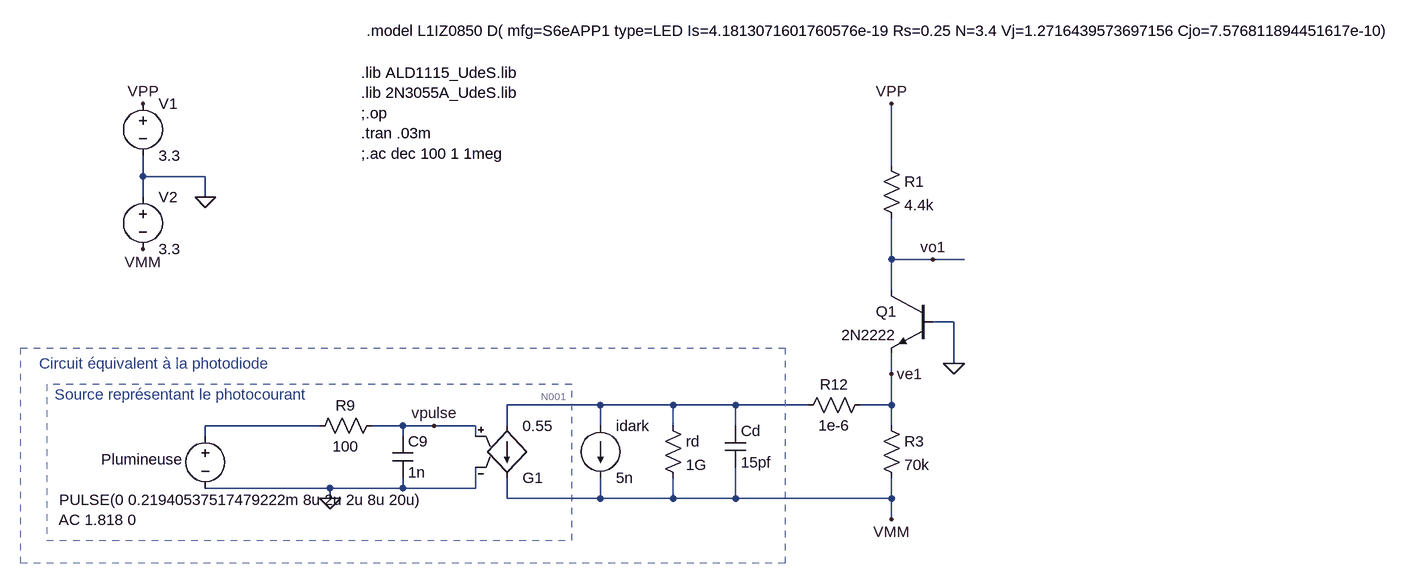
[diagram p0: schematic S6eAPP1_probl_initiale.asc]
S6eAPP1_probl_initiale.asc, the LTspice schematic file:
Version 4
SHEET 1 2260 1556
WIRE 176 48 176 -48
WIRE -976 64 -976 32
WIRE -880 64 -976 64
WIRE -976 96 -976 64
WIRE -880 96 -880 64
WIRE 176 192 176 128
WIRE 240 192 176 192
WIRE 288 192 240 192
WIRE 176 240 176 192
WIRE 272 288 240 288
WIRE 272 352 272 288
WIRE 176 368 176 336
WIRE -272 416 -416 416
WIRE -160 416 -272 416
WIRE -64 416 -160 416
WIRE 48 416 -64 416
WIRE 176 416 176 368
WIRE 176 416 128 416
WIRE -704 448 -880 448
WIRE -576 448 -624 448
WIRE -528 448 -576 448
WIRE -464 448 -528 448
WIRE -416 448 -416 416
WIRE -272 448 -272 416
WIRE -160 448 -160 416
WIRE -64 448 -64 416
WIRE 176 448 176 416
WIRE -880 464 -880 448
WIRE -576 464 -576 448
WIRE -464 464 -464 448
WIRE -688 544 -880 544
WIRE -576 544 -576 528
WIRE -576 544 -688 544
WIRE -464 544 -464 512
WIRE -464 544 -576 544
WIRE -688 560 -688 544
WIRE -416 560 -416 528
WIRE -272 560 -272 528
WIRE -272 560 -416 560
WIRE -160 560 -160 528
WIRE -160 560 -272 560
WIRE -64 560 -64 512
WIRE -64 560 -160 560
WIRE 176 560 176 528
WIRE 176 560 -64 560
WIRE 176 592 176 560
FLAG 272 352 0
FLAG 176 -48 VPP
FLAG -976 -48 VPP
FLAG -976 176 VMM
FLAG -880 96 0
FLAG 176 592 VMM
FLAG 240 192 vo1
FLAG 176 368 ve1
FLAG -688 560 0
FLAG -528 448 vpulse
SYMBOL /npn 240 240 M0
SYMATTR InstName Q1
SYMATTR Value 2N2222
SYMBOL /res 160 32 R0
SYMATTR InstName R1
SYMATTR Value 4.4k
SYMBOL /voltage -976 -64 R0
WINDOW 123 0 0 Left 0
WINDOW 39 24 124 Left 2
SYMATTR InstName V1
SYMATTR Value 3.3
SYMBOL /res 160 432 R0
SYMATTR InstName R3
SYMATTR Value 70k
SYMBOL /voltage -976 80 R0
WINDOW 123 0 0 Left 0
WINDOW 39 0 0 Left 0
SYMATTR InstName V2
SYMATTR Value 3.3
SYMBOL /current -272 448 R0
WINDOW 123 0 0 Left 0
WINDOW 39 0 0 Left 0
SYMATTR InstName idark
SYMATTR Value 5n
SYMBOL /res -176 432 R0
SYMATTR InstName rd
SYMATTR Value 1G
SYMBOL /cap -80 448 R0
SYMATTR InstName Cd
SYMATTR Value 15pf
SYMBOL g2 -416 544 M180
SYMATTR InstName G1
SYMATTR Value 0.55
SYMBOL res -608 432 R90
WINDOW 0 0 56 VBottom 2
WINDOW 3 32 56 VTop 2
SYMATTR InstName R9
SYMATTR Value 100
SYMBOL cap -592 464 R0
SYMATTR InstName C9
SYMATTR Value 1n
SYMBOL voltage -880 448 R0
WINDOW 3 -225 114 Left 2
WINDOW 123 -226 145 Left 2
WINDOW 39 0 0 Left 0
WINDOW 0 -160 52 Left 2
SYMATTR Value PULSE(0 0.21940537517479222m 8u 2u 2u 8u 20u)
SYMATTR Value2 AC 1.818 0
SYMATTR InstName Plumineuse
SYMBOL res 144 400 R90
WINDOW 0 0 56 VBottom 2
WINDOW 3 32 56 VTop 2
SYMATTR InstName R12
SYMATTR Value 1e-6
TEXT -640 -96 Left 2 !.lib ALD1115_UdeS.lib\n.lib 2N3055A_UdeS.lib\n;.op\n.tran .03m\n;.ac dec 100 1 1meg
TEXT -1112 400 Left 2 ;Source représentant le photocourant
TEXT -1136 352 Left 2 ;Circuit équivalent à la photodiode
TEXT -632 -160 Left 2 !.model L1IZ0850 D( mfg=S6eAPP1 type=LED Is=4.1813071601760576e-19 Rs=0.25 N=3.4 Vj=1.2716439573697156 Cjo=7.576811894451617e-10)
RECTANGLE Normal -1124 624 -316 384 1
RECTANGLE Normal -1164 328 12 660 1

The netlist it stands for:
* S6eAPP1_probl_initiale.asc
Q1 vo1 0 ve1 0 2N2222
R1 VPP vo1 4.4k
V1 VPP 0 3.3
R3 ve1 VMM 70k
V2 0 VMM 3.3
idark N001 VMM 5n
rd N001 VMM 1G
Cd N001 VMM 15pf
G1 N001 VMM vpulse 0 0.55
R9 vpulse N002 100
C9 vpulse 0 1n
V§Plumineuse N002 0 PULSE(0 0.21940537517479222m 8u 2u 2u 8u 20u) AC 1.818 0
R12 ve1 N001 1e-6
.model NPN NPN
.model PNP PNP
.lib standard.bjt
.lib ALD1115_UdeS.lib
.lib 2N3055A_UdeS.lib
;.op
.tran .03m
;.ac dec 100 1 1meg
* Source représentant le photocourant
* Circuit équivalent à la photodiode
.model L1IZ0850 D( mfg=S6eAPP1 type=LED Is=4.1813071601760576e-19 Rs=0.25 N=3.4 Vj=1.2716439573697156 Cjo=7.576811894451617e-10)
.backanno
.end

* Results of the author's LTspice run, read from the files saved beside the schematic
* Operating Point, zero values left out:
*   V(vo1) = 3.129 V
*   V(ve1) = -570.3 mV
*   V(vpp) = 3.3 V
*   V(vmm) = -3.3 V
*   V(n001) = -570.3 mV
*   Ic(Q1) = 38.82 µA
*   Ib(Q1) = 188.2 nA
*   Ie(Q1) = -39 µA
*   I(Idark) = 5 nA
*   I(R12) = 7.661 nA
*   I(Rd) = 2.73 nA
*   I(R3) = 39 µA
*   I(R1) = 38.82 µA
*   I(V2) = -39 µA
*   I(V1) = -38.82 µA
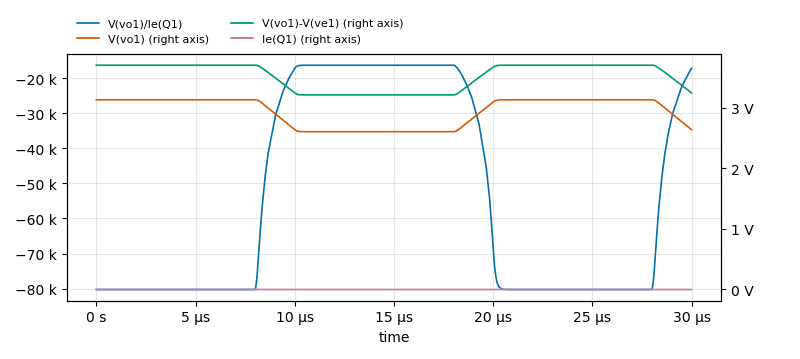
[diagram p1: Transient Analysis of S6eAPP1_probl_initiale.asc, plotted from the saved traces]
* Transient Analysis, 1 run:
*   V(vo1)/Ie(Q1): min -80.23 k, max -16.36 k, average -54.22 k, rms 61.72 k, last -17.24 k
*   V(vo1): min 2.603 V, max 3.129 V, average 2.939 V, rms 2.948 V, last 2.638 V
*   V(vo1)-V(ve1): min 3.21 V, max 3.7 V, average 3.523 V, rms 3.53 V, last 3.243 V
*   Ie(Q1): min -159.2 µA, max -39 µA, average -82.65 µA, rms 98.46 µA, last -153 µA